# Altium project CSB_Project.PrjPcb
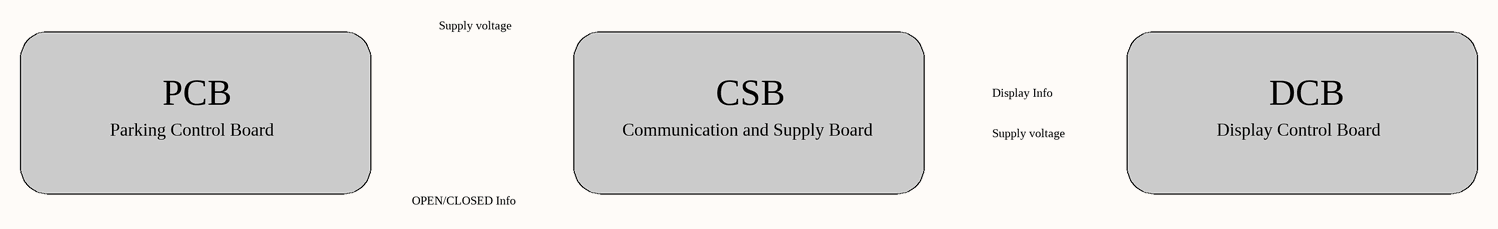
[diagram p0: schema.SchDoc]
3 sheets, 52 parts. Net scope: global (net labels, ports and power ports of the same name join across sheets).
Board file: CSB_PCB.PcbDoc
Sheets:
  schema.SchDoc
  uC_assembly.SchDoc
  Voltage_generation.SchDoc

## Sheet schema.SchDoc
size A3; SheetNumber: 1; SheetTotal: 3

### Notes on the sheet
- Supply voltage
- PCB
- CSB
- Display Info
- DCB
- Parking Control Board
- Communication and Supply Board
- Display Control Board
- OPEN/CLOSED Info
- Designed By:
- Electric DC engine and Battery controller
- AlvaroNJ

## Sheet uC_assembly.SchDoc
size A3; SheetNumber: 2; SheetTotal: 3
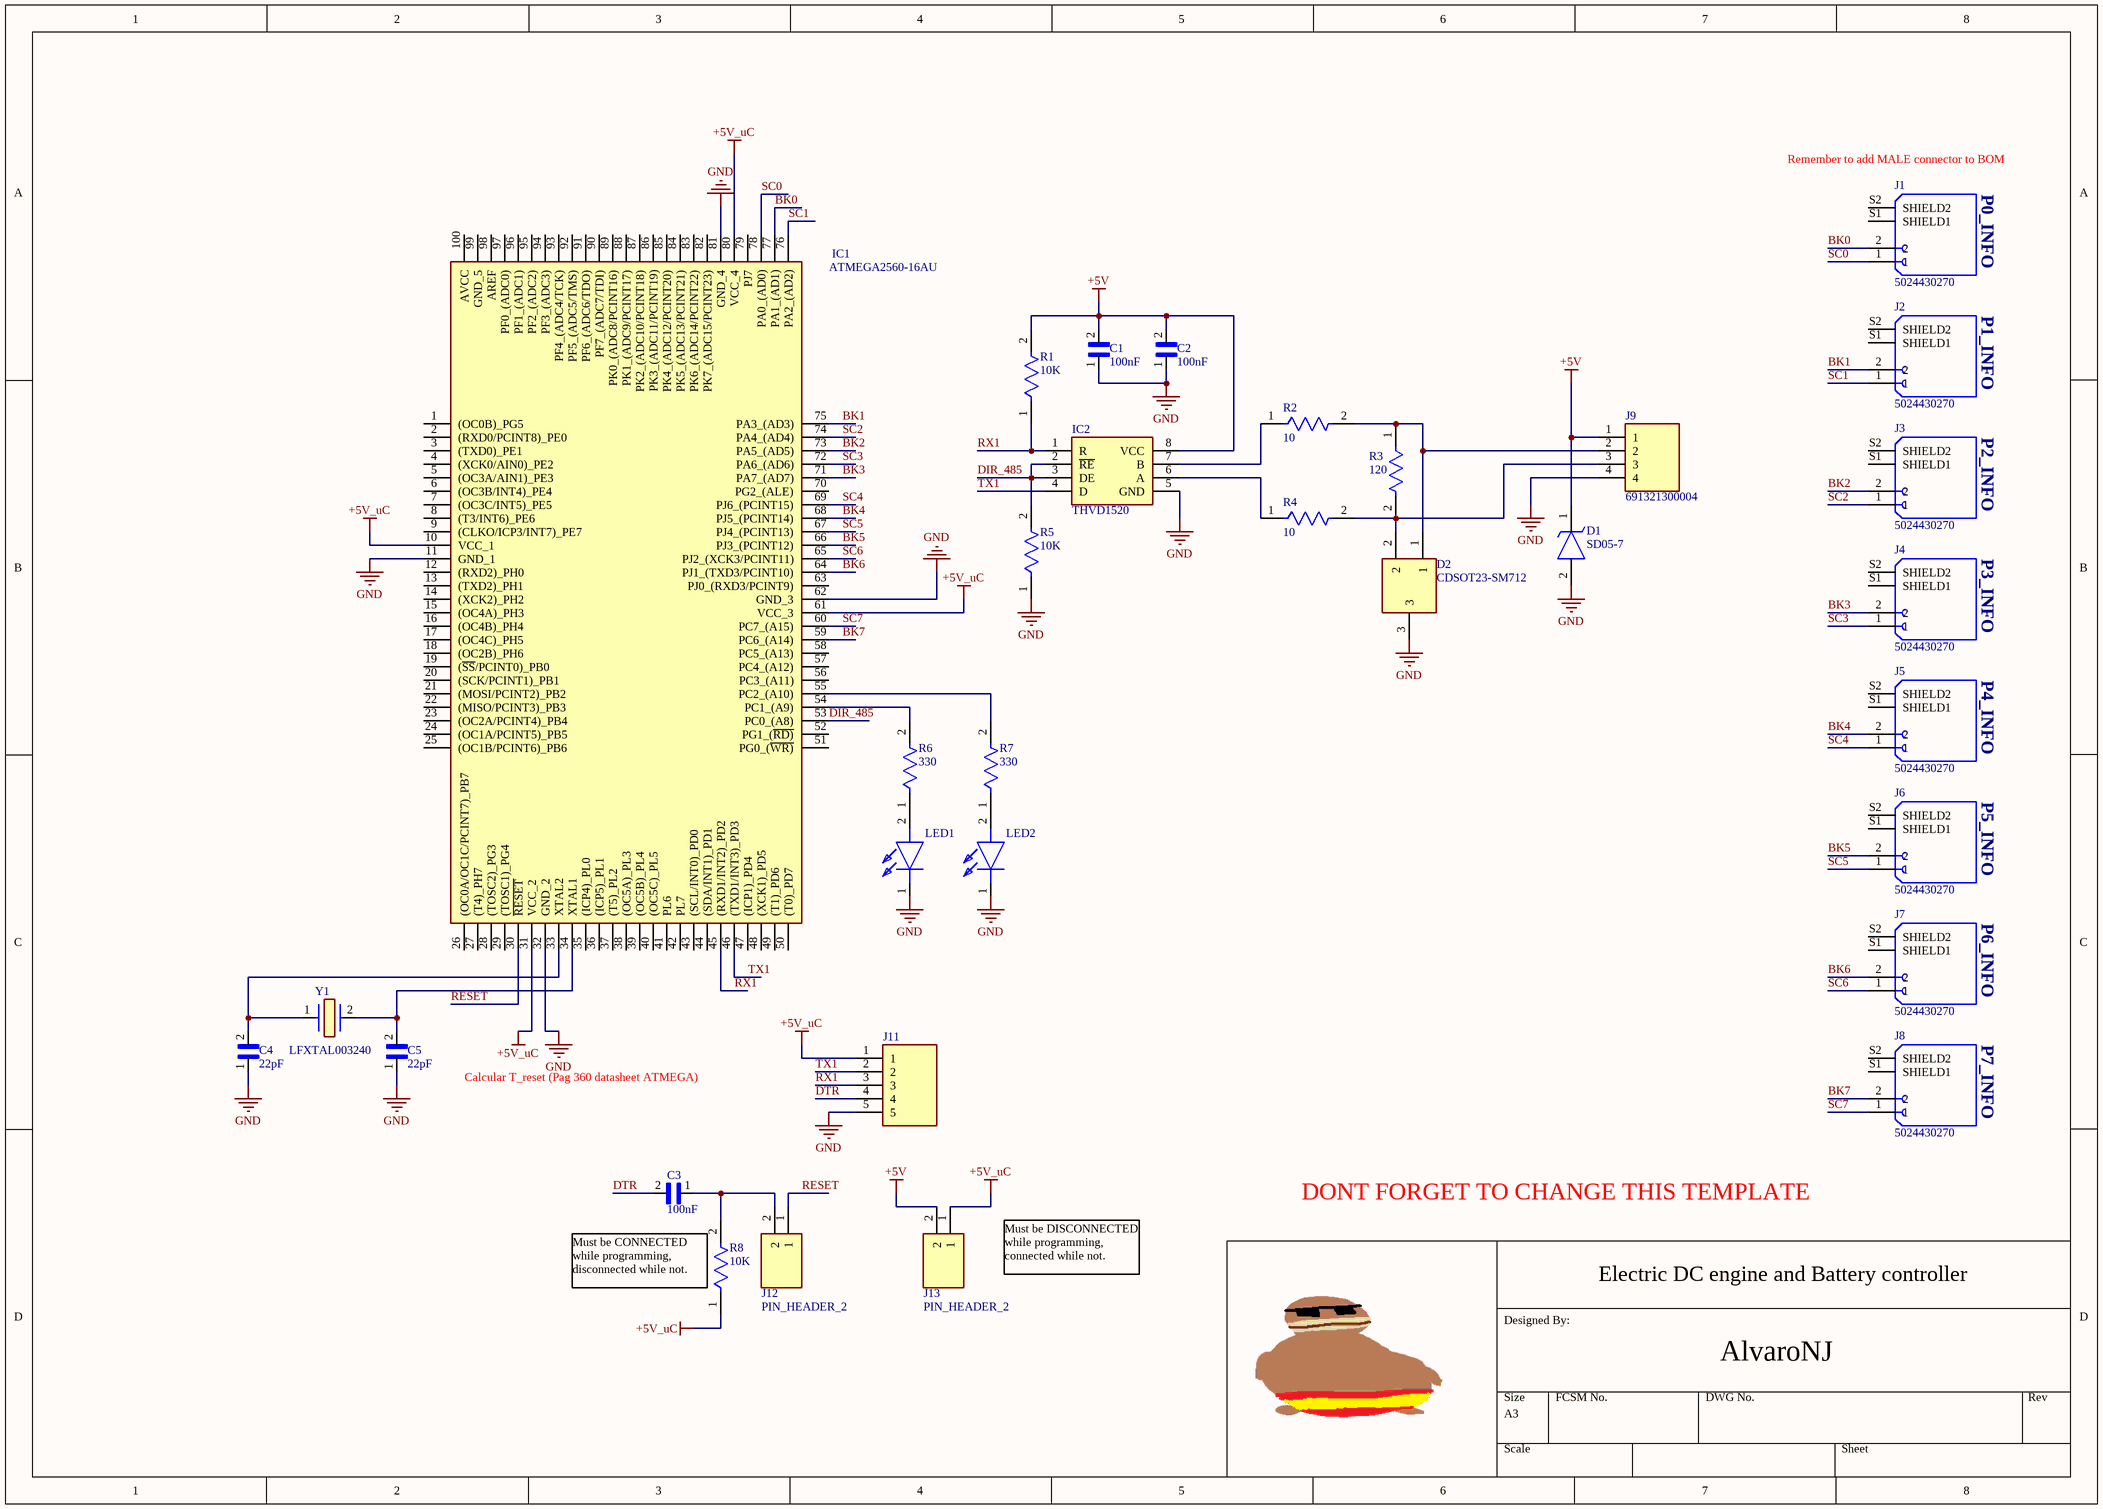
[diagram p1: uC_assembly.SchDoc]

### Parts
C1  100nF  [0603C]
C2  100nF  [0603C]
C3  100nF  [0603C]
C4  22pF  [0603C]
C5  22pF  [0603C]
D1  SD05-7  [SOD2513X120N]
D2  CDSOT23-SM712  [SOT95P230X117-3N]
IC1  ATMEGA2560-16AU  [QFP50P1600X1600X120-100N]
IC2  THVD1520  [SOIC127P600X175-8N]
J1  5024430270  [MOLEX_5024430270]
J2  5024430270  [MOLEX_5024430270]
J3  5024430270  [MOLEX_5024430270]
J4  5024430270  [MOLEX_5024430270]
J5  5024430270  [MOLEX_5024430270]
J6  5024430270  [MOLEX_5024430270]
J7  5024430270  [MOLEX_5024430270]
J8  5024430270  [MOLEX_5024430270]
J9  691321300004  [SHDR4W80P0X381_1X4_1643X720X920P]
J11  MOLEX,_C-GRID_III,_90120,_8_WAY,_1_ROW,_STRAIGHT_PIN_HEADER  [HDRV8W65P0X254_1X8_2010X249X945P - duplicate]  (value not drawn)
J12  PIN_HEADER_2  [PINHEADER2]
J13  PIN_HEADER_2  [PINHEADER2]
LED1  LTST-C191KFKT  [LEDC1608X55N]  (value not drawn)
LED2  LTST-C191KFKT  [LEDC1608X55N]  (value not drawn)
R1  10K  [0603R]
R2  10  [0603R]
R3  120  [1206R]
R4  10  [0603R]
R5  10K  [0603R]
R6  330  [0603R]
R7  330  [0603R]
R8  10K  [0603R]
Y1  LFXTAL003240  [IQD-HC-49-4H]

### Nets
+5V: C1.2 C2.2 D1.1(K) IC2.8(VCC) J9.1 J13.2 R1.2
+5V_uC: IC1.10(VCC_1) IC1.31(VCC_2) IC1.61(VCC_3) IC1.80(VCC_4) J11.1 J13.1 R8.1
GND: C1.1 C2.1 C4.1 C5.1 D1.2(A) D2.3 IC1.11(GND_1) IC1.32(GND_2) IC1.62(GND_3) IC1.81(GND_4) IC2.5(GND) J9.4 J11.5 LED1.1(K) LED2.1(K) R5.1
BK0: IC1.77(PA1_(AD1)) J1.2
BK1: IC1.75(PA3_(AD3)) J2.2
BK2: IC1.73(PA5_(AD5)) J3.2
BK3: IC1.71(PA7_(AD7)) J4.2
BK4: IC1.68(PJ5_(PCINT14)) J5.2
BK5: IC1.66(PJ3_(PCINT12)) J6.2
BK6: IC1.64(PJ1_(TXD3/PCINT10)) J7.2
BK7: IC1.59(PC6_(A14)) J8.2
DIR_485: IC1.53(PC0_(A8)) IC2.2(~{RE}) IC2.3(DE) R5.2
DTR: C3.2 J11.4
RESET: IC1.30(~{RESET}) J12.1
RX1: IC1.45((RXD1/INT2)_PD2) IC2.1(R) J11.3 R1.1
SC0: IC1.78(PA0_(AD0)) J1.1
SC1: IC1.76(PA2_(AD2)) J2.1
SC2: IC1.74(PA4_(AD4)) J3.1
SC3: IC1.72(PA6_(AD6)) J4.1
SC4: IC1.69(PJ6_(PCINT15)) J5.1
SC5: IC1.67(PJ4_(PCINT13)) J6.1
SC6: IC1.65(PJ2_(XCK3/PCINT11)) J7.1
SC7: IC1.60(PC7_(A15)) J8.1
TX1: IC1.46((TXD1/INT3)_PD3) IC2.4(D) J11.2
NetC3_1: C3.1 J12.2 R8.2
NetC4_2: C4.2 IC1.33(XTAL2) Y1.1
NetC5_2: C5.2 IC1.34(XTAL1) Y1.2
NetD2_1: D2.1 J9.2 R2.2 R3.1
NetD2_2: D2.2 J9.3 R3.2 R4.2
NetIC1_54: IC1.54(PC1_(A9)) R6.2
NetIC1_55: IC1.55(PC2_(A10)) R7.2
NetIC2_6: IC2.6(A) R4.1
NetIC2_7: IC2.7(B) R2.1
NetLED1_2: LED1.2(A) R6.1
NetLED2_2: LED2.2(A) R7.1

Not connected (* = marked no-connect by the designer): IC1 1((OC0B)_PG5) 2((RXD0/PCINT8)_PE0) 3((TXD0)_PE1) 4((XCK0/AIN0)_PE2) 5((OC3A/AIN1)_PE3) 6((OC3B/INT4)_PE4) 7((OC3C/INT5)_PE5) 8((T3/INT6)_PE6) 9((CLKO/ICP3/INT7)_PE7) 12((RXD2)_PH0) 13((TXD2)_PH1) 14((XCK2)_PH2) 15((OC4A)_PH3) 16((OC4B)_PH4) 17((OC4C)_PH5) 18((OC2B)_PH6) 19((~{SS}/PCINT0)_PB0) 20((SCK/PCINT1)_PB1) 21((MOSI/PCINT2)_PB2) 22((MISO/PCINT3)_PB3) 23((OC2A/PCINT4)_PB4) 24((OC1A/PCINT5)_PB5) 25((OC1B/PCINT6)_PB6) 26((OC0A/OC1C/PCINT7)_PB7) 27((T4)_PH7) 28((TOSC2)_PG3) 29((TOSC1)_PG4) 35((ICP4)_PL0) 36((ICP5)_PL1) 37((T5)_PL2) 38((OC5A)_PL3) 39((OC5B)_PL4) 40((OC5C)_PL5) 41(PL6) 42(PL7) 43((SCL/INT0)_PD0) 44((SDA/INT1)_PD1) 47((ICP1)_PD4) 48((XCK1)_PD5) 49((T1)_PD6) 50((T0)_PD7) 51(PG0_(~{WR)}) 52(PG1_(~{RD)}) 56(PC3_(A11)) 57(PC4_(A12)) 58(PC5_(A13)) 63(PJ0_(RXD3/PCINT9)) 70(PG2_(ALE)) 79(PJ7) 82(PK7_(ADC15/PCINT23)) 83(PK6_(ADC14/PCINT22)) 84(PK5_(ADC13/PCINT21)) 85(PK4_(ADC12/PCINT20)) 86(PK3_(ADC11/PCINT19)) 87(PK2_(ADC10/PCINT18)) 88(PK1_(ADC9/PCINT17)) 89(PK0_(ADC8/PCINT16)) 90(PF7_(ADC7/TDI)) 91(PF6_(ADC6/TDO)) 92(PF5_(ADC5/TMS)) 93(PF4_(ADC4/TCK)) 94(PF3_(ADC3)) 95(PF2_(ADC2)) 96(PF1_(ADC1)) 97(PF0_(ADC0)) 98(AREF) 99(GND_5) 100(AVCC); J1 S1(SHIELD1) S2(SHIELD2); J2 S1(SHIELD1) S2(SHIELD2); J3 S1(SHIELD1) S2(SHIELD2); J4 S1(SHIELD1) S2(SHIELD2); J5 S1(SHIELD1) S2(SHIELD2); J6 S1(SHIELD1) S2(SHIELD2); J7 S1(SHIELD1) S2(SHIELD2); J8 S1(SHIELD1) S2(SHIELD2)

### Notes on the sheet
- (near J1) Remember to add MALE connector to BOM
- P0_INFO
- P1_INFO
- P2_INFO
- P3_INFO
- P4_INFO
- P5_INFO
- P6_INFO
- P7_INFO
- Calcular T_reset (Pag 360 datasheet ATMEGA)
- DONT FORGET TO CHANGE THIS TEMPLATE
- (near R8) Must be CONNECTED while programming, disconnected while not.
- Must be DISCONNECTED while programming, connected while not.
- Designed By:
- Electric DC engine and Battery controller
- AlvaroNJ

### Library data of the parts
C1-C3 = Ceramic_Capacitor: Cap Ceramic 22pF; Manufacturer: Kyocera; Manufacturer Part number: KGM15BR71E104KT; Value: 100nF
C4 C5 = Ceramic_Capacitor: Cap Ceramic 22pF; Manufacturer: Kyocera; Manufacturer Part number: KGM15ACG1C220KT; Value: 22pF
D1 = SD05-7: TVS Diode (Uni-directional); Manufacturer_Name: Diodes Inc.; Datasheet Link: http://uk.rs-online.com/web/p/products/7514922P; Height: 1.2mm; Manufacturer_Part_Number: SD05-7; Mouser Part Number: 621-SD05-7; Mouser Price/Stock: https://www.mouser.co.uk/ProductDetail/Diodes-Incorporated/SD05-7?qs=nSryOFbzj8LxrCClYHHrlA%3D%3D; Arrow Part Number: SD05-7; Arrow Price/Stock: https://www.arrow.com/en/products/sd05-7/diodes-incorporated
D2 = CDSOT23-SM712: Diode; Manufacturer_Name: Bourns; Datasheet Link: http://uk.rs-online.com/web/p/products/7673728; Height: 1.17mm; Manufacturer_Part_Number: CDSOT23-SM712; Mouser Part Number: 652-CDSOT23-SM712; Mouser Price/Stock: https://www.mouser.co.uk/ProductDetail/Bourns/CDSOT23-SM712?qs=FuI%252BOVLl4%2FLTY%2FGQ265RLA%3D%3D; Arrow Part Number: CDSOT23-SM712; Arrow Price/Stock: https://www.arrow.com/en/products/cdsot23-sm712/bourns?region=europe
IC1 = ATMEGA2560-16AU: Integrated Circuit; Manufacturer_Name: Microchip; Datasheet Link: https://datasheet.datasheetarchive.com/originals/distributors/Datasheets_SAMA/4a5a397fa76c39b5297f4121ace1d84e.pdf; Height: 1.2mm; Manufacturer_Part_Number: ATMEGA2560-16AU; Mouser Part Number: 556-ATMEGA2560-16AU; Mouser Price/Stock: https://www.mouser.co.uk/ProductDetail/Microchip-Technology/ATMEGA2560-16AU?qs=aqrrBurbvGciYmlAokFS0w%3D%3D; Arrow Part Number: ATMEGA2560-16AU; Arrow Price/Stock: https://www.arrow.com/en/products/atmega2560-16au/microchip-technology?region=nac
IC2 = THVD1520: Integrated Circuit; Manufacturer_Name: Texas Instruments; Datasheet Link: https://www.ti.com/lit/ds/symlink/thvd1520.pdf?ts=1621063667522&ref_url=https%253A%252F%252Fwww.google.com%252F; Height: 1.75mm; Manufacturer_Part_Number: THVD1520; Arrow Part Number: THVD1520; Arrow Price/Stock: https://www.arrow.com/en/products/thvd1520/texas-instruments
J1-J8 = 5024430270: 2.00mm Pitch CLIK-Mate Wire-to-Board PCB Receptacle, Single Row, Vertical, with Cover Tape, 2 Circuits; Package: None; MP: 5024430270; Value: *; Availability: Unavailable; Price: None
J9 = 691321300004: Connector; Manufacturer_Name: Wurth Elektronik; Datasheet Link: http://katalog.we-online.de/em/datasheet/6913213000xx.pdf; Height: 9.2mm; Manufacturer_Part_Number: 691321300004; Mouser Part Number: 710-691321300004; Mouser Price/Stock: https://www.mouser.co.uk/ProductDetail/Wurth-Elektronik/691321300004?qs=2kOmHSv6VfS%252BzUmRw3eoyg%3D%3D
J11 = MOLEX,_C-GRID_III,_90120,_8_WAY,_1_ROW,_STRAIGHT_PIN_HEADER: Connector; Datasheet Link: https://www.molex.com/pdm_docs/sd/901200128_sd.pdf; Height: 9.45mm; Manufacturer_Name: Molex; Manufacturer_Part_Number: MOLEX
J12 J13 = PIN_HEADER_2: Connector; Manufacturer_Name: Molex; Datasheet Link: https://www.molex.com/pdm_docs/sd/901200128_sd.pdf; Height: 9.45mm; Manufacturer_Part_Number: MOLEX
LED1 = LTST-C191KFKT: LED; Manufacturer: Lite-On; Manufacturer Part number: LTST-C191KFKT
LED2 = LTST-C191KFKT: LED; Manufacturer: Lite-On; Manufacturer Part number: LTST-C191KGKT
R1 R5 R8 = Resistor: Manufacturer: Yageo; Manufacturer Part number: RC0603FR-1010KL; Value: 10K
R2 R4 = Resistor: Manufacturer: Yageo; Manufacturer Part number: RC0603FR-0710RL; Value: 10
R3 = Resistor: Manufacturer: Yageo; Manufacturer Part number: RC1206FR-07120RL; Value: 120
R6 R7 = Resistor: Manufacturer: Yageo; Manufacturer Part number: RC0603FR-10330RL; Value: 330
Y1 = LFXTAL003240: Crystal or Oscillator; Manufacturer_Name: IQD; Manufacturer_Part_Number: LFXTAL003240

## Sheet Voltage_generation.SchDoc
size A3; SheetNumber: 3; SheetTotal: 3
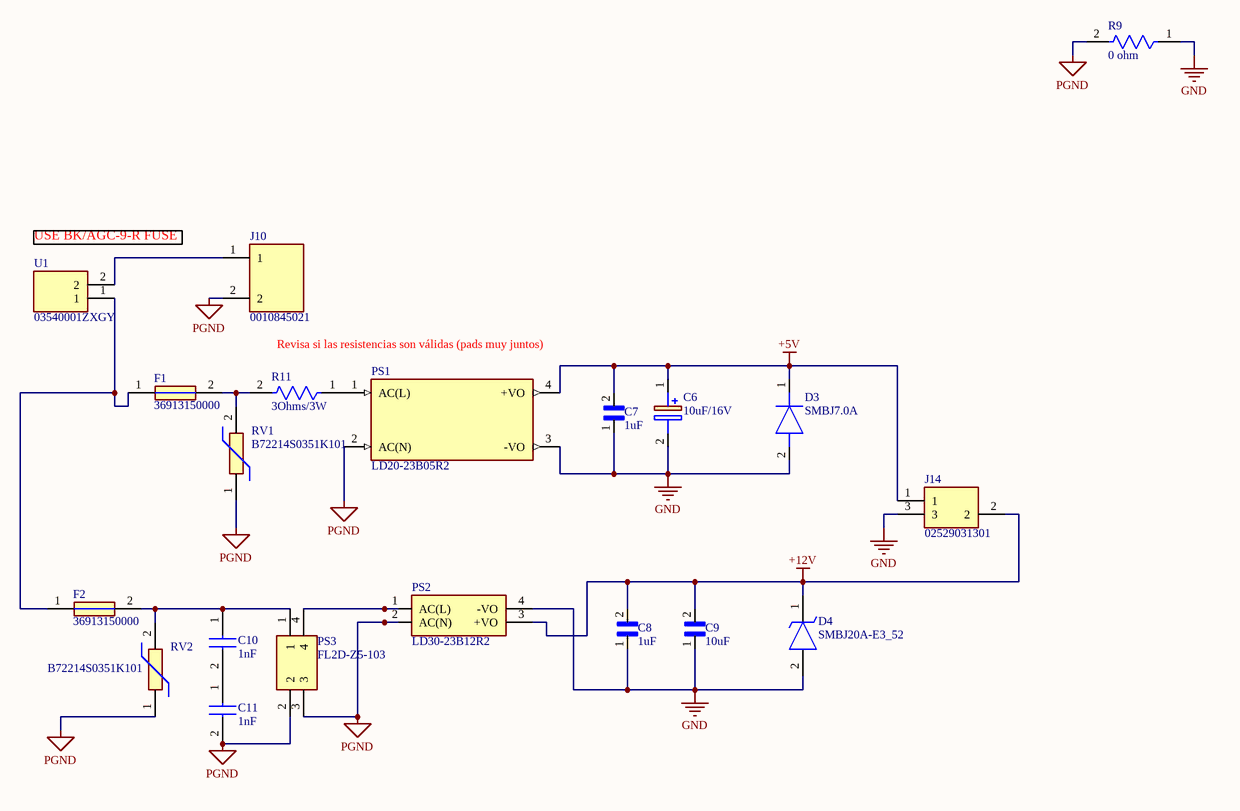
[diagram p2: Voltage_generation.SchDoc]

### Parts
C6  10uF/16V  [CAPPRD200W52D500H1250]
C7  1uF  [1206C]
C8  1uF  [1206C]
C9  10uF  [1206C]
C10  1nF  [C907U102MYVDBA7317]
C11  1nF  [C907U102MYVDBA7317]
D3  SMBJ7.0A  [DIOM5336X244N]
D4  SMBJ20A-E3_52  [DIOM5436X244N]
F1  36913150000  [36913150000]
F2  36913150000  [36913150000]
J10  0010845021  [0010845021_MOLEX]
J14  02529031301  [02529031301]
PS1  LD20-23B05R2  [CONV_LD20-23B05R2]
PS2  LD30-23B12R2  [LD3023B12R2]
PS3  FL2D-Z5-103  [FL2DZ5103]
R9  0 ohm  [0603R]
R11  3Ohms/3W  [Rohm_LTR100_IPC_A]
RV1  B72214S0351K101  [B72214S0351K101]
RV2  B72214S0351K101  [B72214S0351K101]
U1  03540001ZXGY  [Fuse_1]

### Nets
+5V: C6.1(+) C7.2 D3.1(K) J14.1 PS1.4(+VO)
+12V: C8.2 C9.2 D4.1(K) J14.2 PS2.3(+VO)
GND: C6.2(-) C7.1 C8.1 C9.1 D3.2(A) D4.2(A) J14.3 PS1.3(-VO) PS2.4(-VO) R9.1
PGND: C11.2 J10.2 PS1.2(AC(N)) PS2.2(AC(N)) PS3.2 PS3.3 R9.2 RV1.1 RV2.1
NetC10_1: C10.1 F2.2 PS3.1 RV2.2
NetC10_2: C10.2 C11.1
NetF1_1: F1.1 F2.1 U1.1
NetF1_2: F1.2 R11.2 RV1.2
NetJ10_1: J10.1 U1.2
NetPS1_1: PS1.1(AC(L)) R11.1
NetPS2_1: PS2.1(AC(L)) PS3.4

### Notes on the sheet
- (near U1) USE BK/AGC-9-R FUSE
- Revisa si las resistencias son válidas (pads muy juntos)
- Designed By:
- Electric DC engine and Battery controller
- AlvaroNJ

### Library data of the parts
C6 = 860010372001: Capacitor Polarised; Manufacturer_Name: Wurth Elektronik; Datasheet Link: https://ms.componentsearchengine.com/Datasheets/2/860010372001.pdf; Height: 12.5mm; Manufacturer_Part_Number: 860010372001; Mouser Part Number: 710-860010372001; Mouser Price/Stock: https://www.mouser.co.uk/ProductDetail/Wurth-Elektronik/860010372001?qs=0KOYDY2FL29NKHIi2kspeA%3D%3D
C7 = Ceramic_Capacitor: 1 µF ±10% 50V Capacitores cerámicos X7R 1206 (3216 métrico); Manufacturer: Samsung; Manufacturer Part number: CL31B105KBHNNNE; Value: 1uF
C8 = Ceramic_Capacitor: 1 µF ±10% 50V Capacitores cerámicos X7R 1206 (3216 métrico); Manufacturer: Samsung; Manufacturer Part number: CL31B105KCHSNNE; Value: 1uF
C9 = Ceramic_Capacitor: 1 µF ±10% 50V Capacitores cerámicos X7R 1206 (3216 métrico); Manufacturer: Samsung; Manufacturer Part number: CL31A106MBHNNNE; Value: 10uF
C10 C11 = C907U102MYVDBA7317: Capacitor; Manufacturer_Name: KEMET; Datasheet Link: https://content.kemet.com/datasheets/KEM_C1064_X1_400_VAC_Y2_250_VAC.pdf; Height: 7mm; Manufacturer_Part_Number: C907U102MYVDBA7317; Mouser Part Number: 80-C907U102MYVDBAP; Mouser Price/Stock: https://www.mouser.co.uk/ProductDetail/KEMET/C907U102MYVDBA7317?qs=gqcQgTT0fkjWEB%2FDOlQ0cA%3D%3D; Arrow Part Number: C907U102MYVDBA7317; Arrow Price/Stock: https://www.arrow.com/en/products/c907u102myvdba7317/kemet-corporation; Value: 1nF
D3 = SMBJ7.0A: Diode; Manufacturer_Name: HY Electronic; Height: 2.44mm; Manufacturer_Part_Number: SMBJ7.0A
D4 = SMBJ20A-E3_52: TVS Diode (Uni-directional); Manufacturer_Name: Vishay; Manufacturer_Part_Number: SMBJ20A-E3/52; Datasheet Link: http://www.vishay.com/docs/88392/smbj.pdf; Height: 2.44mm; Mouser Part Number: 625-SMBJ20A-E3; Mouser Price/Stock: https://www.mouser.co.uk/ProductDetail/Vishay-General-Semiconductor/SMBJ20A-E3-52?qs=%252BKsK5HlK7GGHijeGSDEfxQ%3D%3D; Arrow Part Number: SMBJ20A-E3/52; Arrow Price/Stock: https://www.arrow.com/en/products/smbj20a-e352/vishay?region=nac
F1 F2 = 36913150000: Fuse; Manufacturer_Name: LITTELFUSE; Datasheet Link: https://componentsearchengine.com/Datasheets/1/36913150000.pdf; Height: 8mm; Manufacturer_Part_Number: 36913150000; Mouser Part Number: 576-36913150000; Mouser Price/Stock: https://www.mouser.co.uk/ProductDetail/Littelfuse/36913150000?qs=A0AD9A9uYPZCz%252Bhb2n2Ctg%3D%3D; Arrow Part Number: 36913150000; Arrow Price/Stock: https://www.arrow.com/en/products/36913150000/littelfuse?region=nac
J10 = 0010845021: Connector; Manufacturer: MOLEX; Manufacturer Part number: 0010845021
J14 = 02529031301: Connector; Manufacturer_Name: HARTING; Datasheet Link: https://b2b.harting.com/files/download/PRD/PDF_DS/PDF_DS_02529031301_EN.pdf; Height: 11.6mm; Manufacturer_Part_Number: 02529031301; Mouser Part Number: 617-02529031301; Mouser Price/Stock: https://www.mouser.co.uk/ProductDetail/HARTING/02529031301?qs=pUKx8fyJudBResgWdfe%2F7g%3D%3D
PS1 = LD20-23B05R2: Enclosed AC DC Converters 1 Uitgang 5V - - - 4A 85 ~ 305 VAC, 100 ~ 430 VDC Input; Manufacturer: Mornsun America, LLC; Digi-Key_Part_Number: 2725-LD20-23B05R2-ND; SnapEDA_Link: https://www.snapeda.com/parts/LD20-23B05R2/MORNSUN/view-part/?ref=snap; Purchase-URL: https://pricing.snapeda.com/search/part/LD20-23B05R2/?ref=eda; Package: CUSTOM-4 MORNSUN; Check_prices: https://www.snapeda.com/parts/LD20-23B05R2/MORNSUN/view-part/?ref=eda; Value: *; Manufacturer Part number: LD20-23B05R2
PS2 = LD30-23B12R2: Power Supply; Manufacturer_Name: Mornsun Power; Datasheet Link: https://www.mornsun-power.com/html/pdf/LD30-23B12R2.html; Height: 24.5mm; Manufacturer_Part_Number: LD30-23B12R2
PS3 = FL2D-Z5-103: Power Supply; Manufacturer_Name: Mornsun Power; Datasheet Link: https://datasheet.lcsc.com/szlcsc/1811091611_MORNSUN-Guangzhou-S-T-FL2D-Z5-103_C191603.pdf; Height: 18mm; Manufacturer_Part_Number: FL2D-Z5-103
R9 = Resistor: Manufacturer: Yageo; Manufacturer Part number: RC0603FR-070RL; Value: 0 ohm
R11 = Resistor: 3 Ohms ±5% 3W Resistencia en microprocesador Ancho 2512 (6432 métrico), 1225 AEC-Q200 automotriz, protección contra impulsos Película gruesa; Manufacturer: Rohm; Manufacturer Part number: LTR100JZPJ3R0; Value: 3Ohms/3W
RV1 RV2 = B72214S0351K101: Varistor; Manufacturer_Name: TDK; Datasheet Link: https://product.tdk.com/system/files/dam/doc/product/protection/voltage/lead-disk-varistor/data_sheet/70/db/var/siov_leaded_standard.pdf; Height: 18.5mm; Manufacturer_Part_Number: B72214S0351K101; Arrow Part Number: B72214S0351K101; Arrow Price/Stock: https://www.arrow.com/en/products/b72214s0351k101/epcos-tdk?region=nac
U1 = 03540001ZXGY: Undefined or Miscellaneous; Manufacturer_Name: LITTELFUSE; Datasheet Link: https://m.littelfuse.com/~/media/electronics/datasheets/fuse_blocks/littelfuse_fuse_block_354_datasheet.pdf.pdf; Height: 13mm; Manufacturer_Part_Number: 03540001ZXGY; Mouser Part Number: 576-03540001ZXGY; Mouser Price/Stock: https://www.mouser.co.uk/ProductDetail/Littelfuse/03540001ZXGY?qs=2VFNtWizgieffhgauIF6XA%3D%3D; Arrow Part Number: 03540001ZXGY; Arrow Price/Stock: https://www.arrow.com/en/products/03540001zxgy/littelfuse?region=nac

## Nets that join several sheets
+5V: uC_assembly (7 pins), Voltage_generation (5 pins)
GND: uC_assembly (16 pins), Voltage_generation (10 pins)